# EAGLE schematic usb-c (EAGLE 9.6.2)
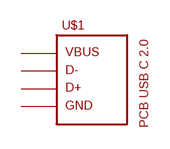
[diagram p0: schematic, sheet 1]

## Parts
U$1  PCB_USB_C_2.0DS_3  [USB_TYPE_C_DS_3]
Unconnected: U$1.A1(GND) U$1.A4(VBUS) U$1.A6(D+) U$1.A7(D-) U$1.A9(VBUS) U$1.A12(GND) U$1.B1(GND) U$1.B6(D+) U$1.B7(D-) U$1.B12(GND)

## Library data of the parts
U$1 = usb_pcb_connectors:PCB_USB_C_2.0